# EAGLE design Brake Light Board (1) (EAGLE 6.5.0)
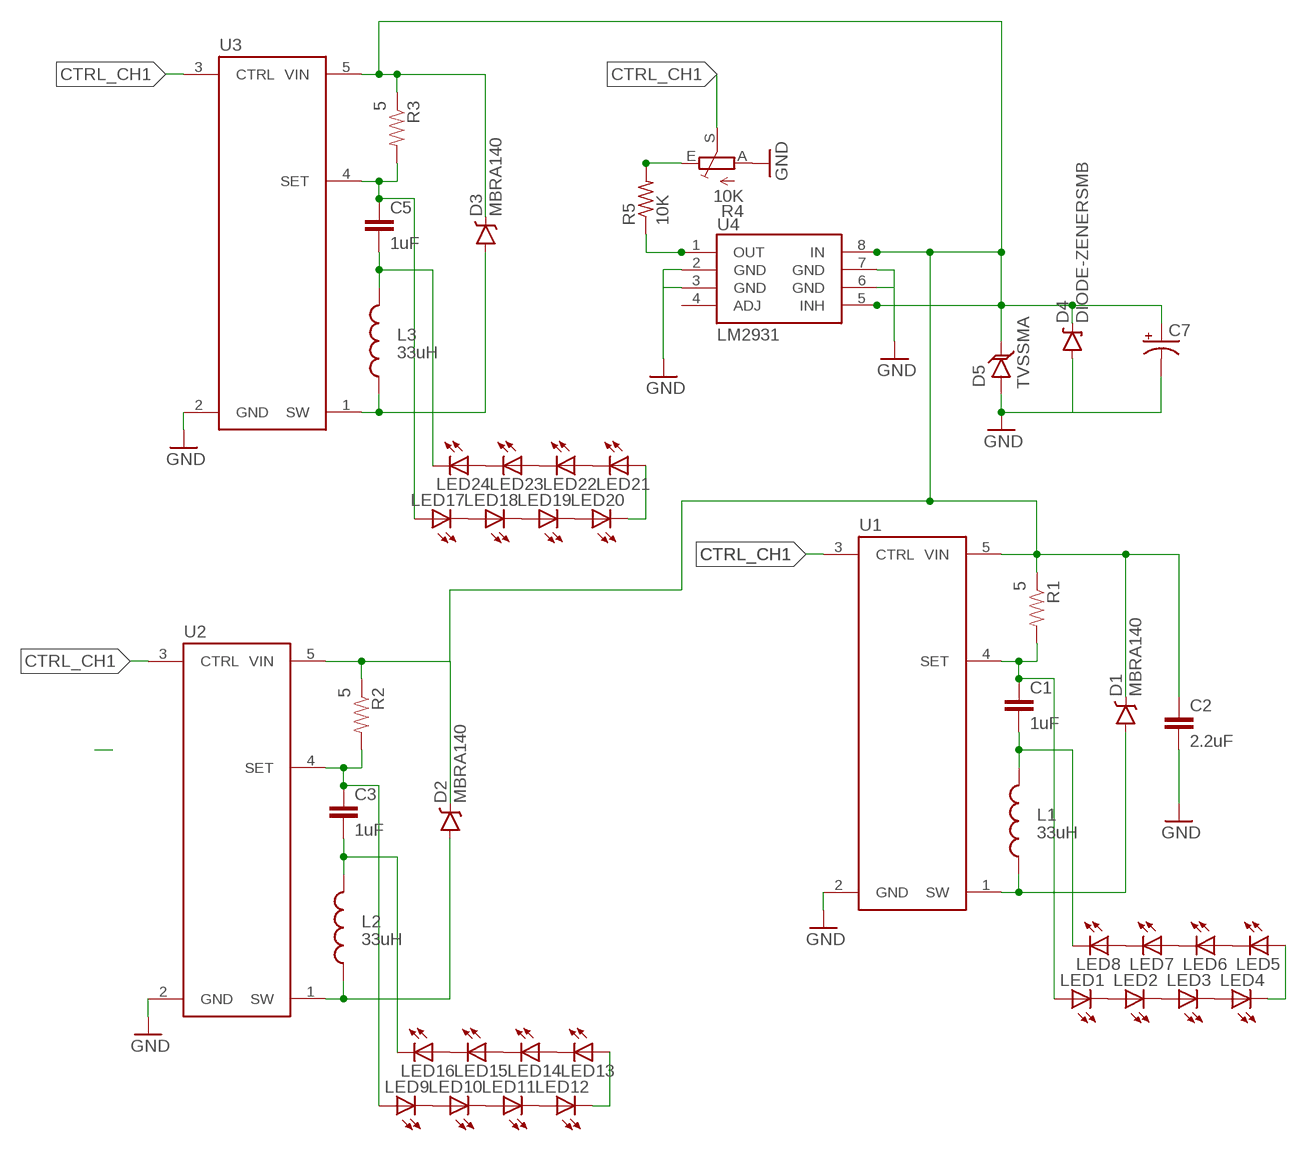
[diagram p0: schematic, sheet 1]

## Parts
C1  1uF  1.0UF50V10%(1206)  [1206]
C2  2.2uF  2.2UF50V10%(1206)  [1206]
C3  1uF  1.0UF50V10%(1206)  [1206]
C5  1uF  1.0UF50V10%(1206)  [1206]
C7  CAP_POL6032  [EIA6032]
D1  MBRA140  DIODE-SCHOTTKY-MBRA140  [SMA-DIODE]
D2  MBRA140  DIODE-SCHOTTKY-MBRA140  [SMA-DIODE]
D3  MBRA140  DIODE-SCHOTTKY-MBRA140  [SMA-DIODE]
D4  DIODE-ZENERSMB  [SMB-DIODE]
D5  TVSSMA  [SMA-DIODE]
L1  33uH  INDUCTORBOURNS_SRN6045  [SRN6045]
L2  33uH  INDUCTORBOURNS_SRN6045  [SRN6045]
L3  33uH  INDUCTORBOURNS_SRN6045  [SRN6045]
LED1  LED5MM  [LED5MM]
LED2  LED5MM  [LED5MM]
LED3  LED5MM  [LED5MM]
LED4  LED5MM  [LED5MM]
LED5  LED5MM  [LED5MM]
LED6  LED5MM  [LED5MM]
LED7  LED5MM  [LED5MM]
LED8  LED5MM  [LED5MM]
LED9  LED5MM  [LED5MM]
LED10  LED5MM  [LED5MM]
LED11  LED5MM  [LED5MM]
LED12  LED5MM  [LED5MM]
LED13  LED5MM  [LED5MM]
LED14  LED5MM  [LED5MM]
LED15  LED5MM  [LED5MM]
LED16  LED5MM  [LED5MM]
LED17  LED5MM  [LED5MM]
LED18  LED5MM  [LED5MM]
LED19  LED5MM  [LED5MM]
LED20  LED5MM  [LED5MM]
LED21  LED5MM  [LED5MM]
LED22  LED5MM  [LED5MM]
LED23  LED5MM  [LED5MM]
LED24  LED5MM  [LED5MM]
R1  5  0.3OHM-1/8W-1%(0805)  [0805]
R2  5  0.3OHM-1/8W-1%(0805)  [0805]
R3  5  0.3OHM-1/8W-1%(0805)  [0805]
R4  10K  TRIM_EU-B25P  [B25P]
R5  10K  R-US_R0805  [R0805]
U1  AL8805  [SOT23-5]
U2  AL8805  [SOT23-5]
U3  AL8805  [SOT23-5]
U4  LM2931  [SO08]

## Nets
CTRL_CH1: R4.S U1.3(CTRL) U2.3(CTRL) U3.3(CTRL)
GND: C2.2 C7.P$2(-) D4.A D5.A R4.A U1.2(GND) U2.2(GND) U3.2(GND) U4.2(GND) U4.6(GND) U4.7(GND)
N$1: LED1.K(C) LED2.A
N$2: LED2.K(C) LED3.A
N$3: LED3.K(C) LED4.A
N$4 [power]: C1.2 L1.2 LED8.K(C)
N$5: LED5.K(C) LED6.A
N$6: LED6.K(C) LED7.A
N$7: LED7.K(C) LED8.A
N$8: LED9.K(C) LED10.A
N$9: LED4.K(C) LED5.A
N$10: LED10.K(C) LED11.A
N$11: LED11.K(C) LED12.A
N$12 [power]: C3.2 L2.2 LED16.K(C)
N$13: LED13.K(C) LED14.A
N$14: LED14.K(C) LED15.A
N$15: LED15.K(C) LED16.A
N$16: LED12.K(C) LED13.A
N$17: LED17.K(C) LED18.A
N$18: LED18.K(C) LED19.A
N$19: LED19.K(C) LED20.A
N$20 [power]: C5.2 L3.2 LED24.K(C)
N$21: LED21.K(C) LED22.A
N$22: LED22.K(C) LED23.A
N$23: LED23.K(C) LED24.A
N$24: LED20.K(C) LED21.A
N$25: R4.E R5.2
N$26: R5.1 U4.1(OUT)
N$28: U4.3(GND)
OUT+: C1.1 LED1.A R1.2 U1.4(SET)
OUT+1: C3.1 LED9.A R2.2 U2.4(SET)
OUT+2: C5.1 LED17.A R3.2 U3.4(SET)
SW: D1.A L1.1 U1.1(SW)
SW1: D2.A L2.1 U2.1(SW)
SW2: D3.A L3.1 U3.1(SW)
VIN: C2.1 C7.P$1(+) D1.C D2.C D3.C D4.C D5.C R1.1 R2.1 R3.1 U1.5(VIN) U2.5(VIN) U3.5(VIN) U4.5(INH) U4.8(IN)
Unconnected: U4.4(ADJ)

## Library data of the parts
C1 C3 C5 = SparkFun-Capacitors:1.0UF50V10%(1206): CAP-09822; PROD_ID: CAP-09822; VALUE: 1.0uF
C2 = SparkFun-Capacitors:2.2UF50V10%(1206): CAP-10009; PROD_ID: CAP-10009; VALUE: 2.2UF
C7 = SparkFun-Capacitors:CAP_POL: Capacitor Polarized These are standard SMD and PTH capacitors. Normally 10uF, 47uF, and 100uF in electrolytic and tantalum varieties. Always verify the external diameter of the through hole cap, it varies with capacity, voltage, and manufacturer. The EIA devices should be standard.
D1-D3 = SparkFun-DiscreteSemi:DIODE-SCHOTTKY: Schottky diodes in SFE's production catalog BAT20J 1A 23V 0.62Vf RB751 120mA 40V 0.37Vf PMEG4005EJ 0.5A 40V 0.42Vf MBRA140 1A 40V 0.5Vf B340A 3A 40V SMA; PROD_ID: DIO-08053
D4 = SparkFun-DiscreteSemi:DIODE-ZENER: Zener Diode Production Part - 8199 3.4V Zener Voltage
D5 = SparkFun-DiscreteSemi:TVS: Transient voltage suppressor- prevents ESD on inputs.
L1-L3 = SparkFun-Passives:INDUCTOR: Inductors Basic Inductor/Choke - 0603 and 1206. Footprints are not proven and vary greatly between part numbers. SRN6045- 33uH, 20% 1.4A SDR0403-560KL - 56uH, 10%, 500mA RMS/740mA peak; PROD_ID: NDUC-11627
LED1-LED24 = led:LED: LED OSRAM: - CHIPLED LG R971, LG N971, LY N971, LG Q971, LY Q971, LO R971, LY R971 LH N974, LH R974 LS Q976, LO Q976, LY Q976 LO Q996 - Hyper CHIPLED LW Q18S LB Q993, LB Q99A, LB R99A - SideLED LS A670, LO A670, LY A670, LG A670, LP A670 LB A673, LV A673, LT A673, LW A673 LH A674 LY A675 LS A676, LA A676, LO A676, LY A676, LW A676 LS A679, LY A679, LG A679 - Hyper Micro SIDELED® LS Y876, LA Y876, LO Y876, LY Y876 LT Y87S - SmartLED LW L88C, LW L88S LB L89C, LB L89S, LG L890 LS L89K, LO L89K, LY L89K LS L896, LA L896, LO L896, LY L896 - TOPLED LS T670, LO T670, LY T670, LG T670, LP T670 LSG T670, LSP T670, LSY T670, LOP T670, LYG T670 LG T671, LOG T671, LSG T671 LB T673, LV T673, LT T673, LW T673 LH T674 LS T676, LA T676, LO T676, LY T676, LB T676, LH T676, LSB T676, LW T676 LB T67C, LV T67C, LT T67C, LS T67K, LO T67K, LY T67K, LW E67C LS E67B, LA E67B, LO E67B, LY E67B, LB E67C, LV E67C, LT E67C LW T67C LS T679, LY T679, LG T679 LS T770, LO T770, LY T770, LG T770, LP T770 LB T773, LV T773, LT T773, LW T773 LH T774 LS E675, LA E675, LY E675, LS T675 LS T776, LA T776, LO T776, LY T776, LB T776 LHGB T686 LT T68C, LB T68C - Hyper Mini TOPLED® LB M676 - Mini TOPLED Santana® LG M470 LS M47K, LO M47K, LY M47K Source: http://www.osram.convergy.de LUXEON: - LUMILED® LXK2-PW12-R00, LXK2-PW12-S00, LXK2-PW14-U00, LXK2-PW14-V00 LXK2-PM12-R00, LXK2-PM12-S00, LXK2-PM14-U00 LXK2-PE12-Q00, LXK2-PE12-R00, LXK2-PE12-S00, LXK2-PE14-T00, LXK2-PE14-U00 LXK2-PB12-K00, LXK2-PB12-L00, LXK2-PB12-M00, LXK2-PB14-N00, LXK2-PB14-P00, LXK2-PB14-Q00 LXK2-PR12-L00, LXK2-PR12-M00, LXK2-PR14-Q00, LXK2-PR14-R00 LXK2-PD12-Q00, LXK2-PD12-R00, LXK2-PD12-S00 LXK2-PH12-R00, LXK2-PH12-S00 LXK2-PL12-P00, LXK2-PL12-Q00, LXK2-PL12-R00 Source: www.luxeon.com KINGBRIGHT: KA-3528ASYC Source: www.kingbright.com
R1-R3 = SparkFun-Resistors:0.3OHM-1/8W-1%(0805): RES-11622; PROD_ID: RES-11622; VALUE: 0.3
R4 = pot:TRIM_EU-: POTENTIOMETER
R5 = resistor:R-US_: RESISTOR, American symbol
U1-U3 = SparkFun-PowerIC:AL8805: Constant current LED driver PWM-able 1MHz switch freq 6V-36V Up to 1A LED current; PROD_ID: IC-11626; VALUE: AL8805WS
U4 = SparkFun-PowerIC:LM2931: LDO regulator with reverse battery protection- very durable!

## Net classes
0 default: width 0.254 mm
1 power: width 0.508 mm

## Board
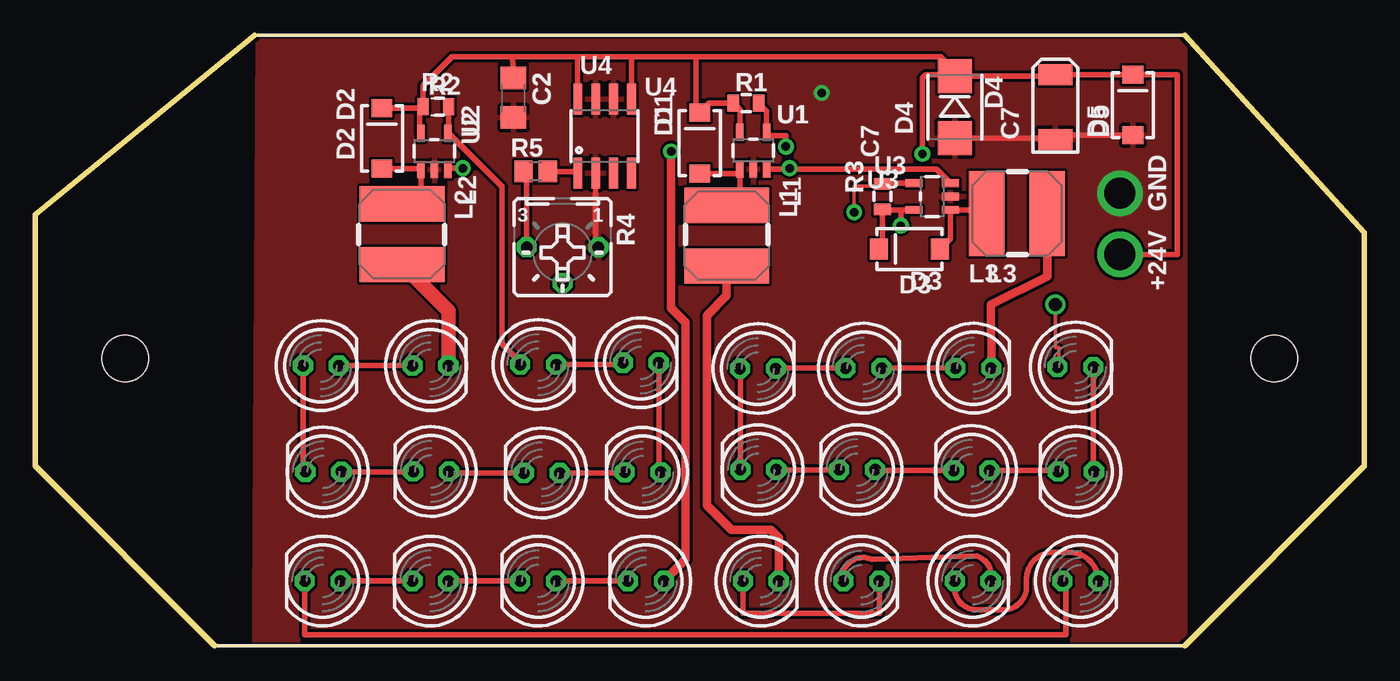
[diagram p1: board, top side]
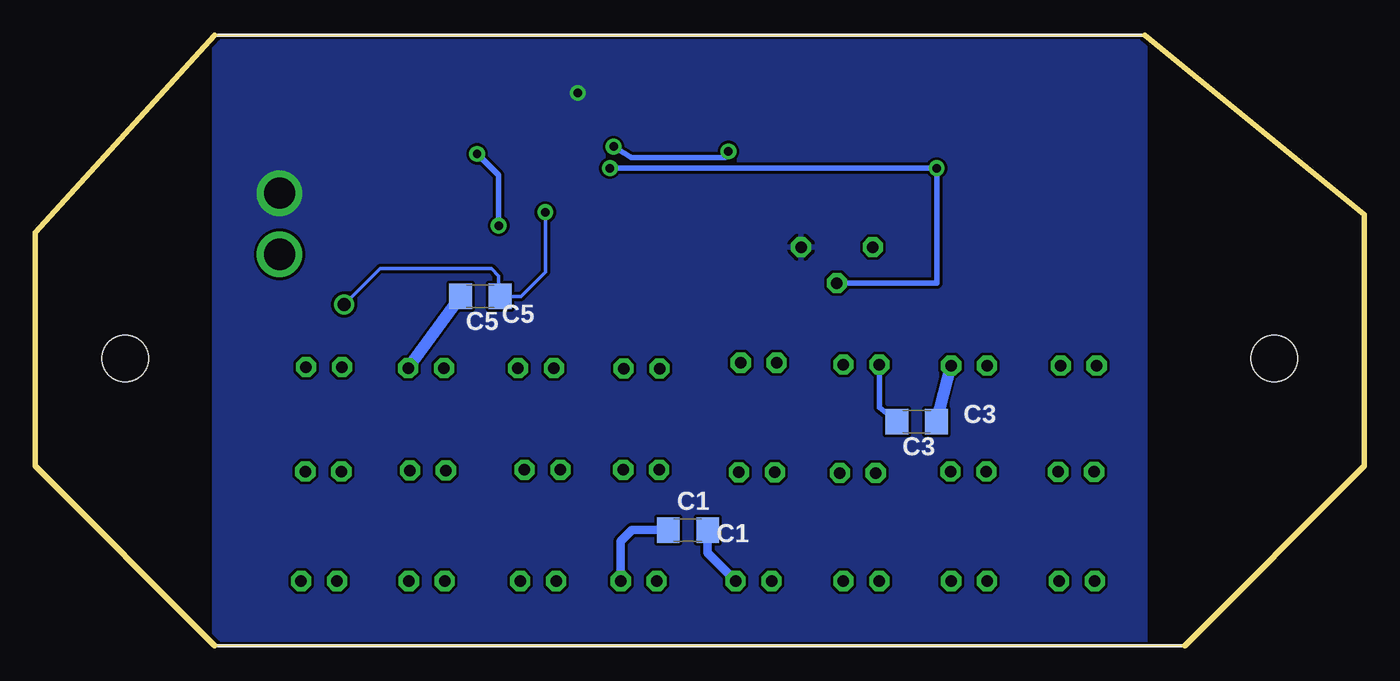
[diagram p2: board, bottom side, seen from below]

Size 93.98 x 43.18 mm. Coordinates in mm from the lower left corner, seen from the top.
Outline: 12.7,0 81.28,0 93.98,12.7 93.98,29.21 81.28,43.18 15.49,43.18 0,30.48 0,12.7 12.7,0
Copper layers (1*16): Top 0.035mm / dielectric 1.5mm / Bottom 0.035mm
Design rules "SparkFun": minimum track width 8mil, minimum drill 20mil, track to track 8mil, track to pad 8mil, pad to pad 8mil, via to via 8mil, smd to smd 8mil, copper to edge 10mil, drill to drill 8mil, minimum pad ring 12mil, minimum via ring 10mil, stop-mask expansion 4mil, vias tented up to drill 25mil, thermal gap 10mil
Holes 3.3 mm at 6.35,20.32 87.63,20.32

### Footprints (pad centres in the part's own frame; a part is rotated, then mirrored left to right if it is on the bottom)
1206 = smd 1.6 x 1.8: 1 -1.4,0; 2 1.4,0
EIA6032 = smd 1.5 x 2.4: P$1 -2.3,0; P$2 2.3,0
SMA-DIODE = smd 1.27 x 1.47: A -2.15,0; C 2.15,0
SMB-DIODE = smd 2.4 x 2.4: A 2.2,0; C -2.2,0
SRN6045 = smd 2.5 x 6: 1 -2.175,-0.175; 2 2.125,-0.175
LED5MM = drill 0.813 octagon: A -1.27,0; K 1.27,0
0805 = smd 0.8 x 1.2: 1 -0.9,0; 2 0.9,0
B25P = drill 0.813 octagon: A -2.54,0; E 2.54,0; S 0,2.54
R0805 = smd 1.3 x 1.5: 1 -0.85,0; 2 0.85,0
SOT23-5 = smd 0.55 x 1.2: 1 -0.95,-1.3; 2 0,-1.3; 3 0.95,-1.3; 4 0.95,1.3; 5 -0.95,1.3
SO08 = smd 0.61 x 2.21: 1 -1.905,-2.616; 2 -0.635,-2.616; 3 0.635,-2.616; 4 1.905,-2.616; 5 1.905,2.616; 6 0.635,2.616; 7 -0.635,2.616; 8 -1.905,2.616

### Placement (x,y rotation side)
C1  47.83,8.18 180 bottom
C2  33.81,38.76 270 top
C3  31.65,15.85 0 bottom
C5  62.51,24.71 180 bottom
C7  72.14,38.1 270 top
D1  46.99,35.56 90 top
D2  24.51,35.89 90 top
D3  61.82,28.07 180 top
D4  65.02,38.1 270 top
D5  77.62,38.25 90 top
L1  49.07,28.98 270 top
L2  26.11,29.08 270 top
L3  69.44,30.73 0 top
LED1  43.18,4.57 180 top
LED2  35.56,4.57 180 top
LED3  27.94,4.57 180 top
LED4  20.32,4.57 180 top
LED5  73.91,4.57 0 top
LED6  66.29,4.57 0 top
LED7  58.42,4.57 0 top
LED8  51.31,4.57 0 top
LED9  35.56,19.89 0 top
LED10  42.82,20.02 0 top
LED11  42.95,12.27 180 top
LED12  35.81,12.22 180 top
LED13  27.99,12.32 180 top
LED14  20.37,12.29 180 top
LED15  20.19,19.81 0 top
LED16  27.94,19.81 0 top
LED17  73.56,19.71 0 top
LED18  73.61,12.32 180 top
LED19  66.22,12.4 180 top
LED20  58.12,12.45 180 top
LED21  51.13,12.45 180 top
LED22  51.1,19.61 0 top
LED23  58.57,19.63 0 top
LED24  66.34,19.63 0 top
R1  50.27,38.38 0 top
R2  28.32,38.13 0 top
R3  59.92,31.78 90 top
R4  37.29,28.19 180 top
R5  35.38,33.55 180 top
U1  50.77,35.03 0 top
U2  28.22,34.98 0 top
U3  63.42,31.78 90 top
U4  40.26,36.04 0 top

### Tracks (layer width: path | path; a pad name or v marks a point on that pad's centre or on a via)
CTRL_CH1  (via drill 0.6)
  Top 0.406: 51.72,33.68 U1.3 52.83,33.73 | U3.3 63.72,33.73 52.83,33.73 | v30.23,33.78 29.21,33.78 U2.3 | v53.34,33.78 52.83,33.73
  Bottom 0.406: v53.34,33.78 v30.23,33.78 30.23,25.65 R4.S
GND  (via drill 0.6 pad 1.02, 2.2)
  Top 0.406: D5.A 72.14,36.1 C7.P$2 72.04,35.9 D4.A | R4.A 39.62,28.4 U4.2
  other vias: 76.71,32 55.63,39.12
  pour Top: 15.75,43.18 81.28,43.18 81.28,0 15.49,0 15.49,2.54
  pour Bottom: 15.49,43.18 81.28,43.18 81.28,0 15.49,0
N$1
  Top 0.406: LED2.A LED1.K
N$2
  Top 0.406: LED3.A LED2.K
N$3
  Top 0.406: LED4.A LED3.K
N$4
  Top 0.61: L1.2 48.9,24.77 47.5,23.37 47.5,9.91 C1.2 52.02,8.18 52.58,7.62 LED8.K
  Bottom 0.61: C1.2 51.76,8.18 52.58,7.37 LED8.K
N$5
  Top 0.406: LED6.A 65.02,4.06 arc90 66.55,2.54 68.33,2.54 arc90 70.1,4.06 70.1,4.57 arc-90 71.88,6.6 73.15,6.6 arc-90 LED5.K
N$6
  Top 0.406: LED7.A 57.15,5.33 arc-90 59.18,6.1 66.55,6.35 arc-90 LED6.K
N$7
  Top 0.406: LED8.A 50.04,2.29 59.69,2.29 LED7.K
N$8
  Top 0.406: LED10.A 41.55,19.89 LED9.K
N$9
  Top 0.406: LED4.K 19.05,0.76 72.9,0.76 72.9,4.57 LED5.A
N$10
  Top 0.406: LED10.K 44.09,12.27 LED11.A
N$11
  Top 0.406: LED11.K 41.68,12.22 LED12.A
N$12
  Top 1.016: L2.2 29.21,23.68 LED16.K
  Bottom 0.813: C3.2 LED16.K
N$13
  Top 0.406: LED13.K 26.72,12.29 LED14.A
N$14
  Top 0.406: LED15.A 18.92,12.29 LED14.K
N$15
  Top 0.406: LED15.K LED16.A
N$16
  Top 0.406: LED13.A 29.26,12.22 LED12.K
N$17
  Top 0.406: LED17.K 74.83,12.32 LED18.A
N$18
  Top 0.406: LED19.A 72.34,12.39 LED18.K
N$19
  Top 0.406: LED19.K 59.38,12.39 LED20.A
N$20
  Top 0.61: L3.2 71.57,26.1 67.56,24.13 LED24.K
  Bottom 0.813: LED24.K C5.2
N$21
  Top 0.406: LED22.A 49.86,19.61 LED21.K
N$22
  Top 0.406: LED23.A 52.38,19.63 LED22.K
N$23
  Top 0.406: LED24.A LED23.K
N$24
  Top 0.406: LED21.A LED20.K
N$25
  Top 0.406: R5.2 34.75,33.55 R4.E
N$26
  Top 0.406: R5.1 38.35,33.55 U4.1
OUT+  (via drill 0.6)
  Top 0.406: R1.2 51.72,37.82 U1.4 51.82,36.32 51.82,36.07 53.09,36.07 v53.09,35.31
  Top 0.61: LED1.A 45.97,6.1 45.97,22.86 44.96,23.88 v44.96,34.98
  Bottom 0.406: v53.09,35.31 51.82,34.54 45.21,34.54 v44.96,34.98
  Bottom 0.61: C1.1 46.43,6.55 LED1.A
OUT+1
  Top 0.406: U2.4 29.22,36.28 | 29.22,36.28 R2.2 | 29.22,36.28 33.02,32.48 33.02,21.34 34.04,20.32 34.29,20.32 LED9.A
  Bottom 0.406: C3.1 34.29,16.84 LED9.A
OUT+2  (via drill 0.6, 0.9)
  Top 0.254: v57.91,30.67 57.91,32.51 59.75,32.51 R3.2 | LED17.A 72.39,19.81 72.39,21.08 72.14,21.08 v72.14,24.13
  Top 0.406: R3.2 59.97,32.73 U3.4
  Bottom 0.254: v57.91,30.67 57.91,26.42 59.61,24.71 C5.1 61.21,24.89 61.21,26.16 61.72,26.67 69.6,26.67 v72.14,24.13
SW
  Top 0.406: L1.1 49.82,31.16 U1.1 49.82,33.41 D1.A
SW1
  Top 0.406: D2.A 27.27,33.74 U2.1 27.27,31.26 L2.1
SW2
  Top 0.406: D3.A 64.72,28.82 U3.1 67.27,30.82 L3.1
VIN  (via drill 0.6, 2.2)
  Top 0.406: 80.77,27.67 80.77,27.69 | 80.77,27.69 80.77,40.39 77.62,40.39 D5.C C7.P$1 72.04,40.3 D4.C | D3.C 59.92,28.31 R3.1 59.97,30.82 61.21,30.82 | 61.21,30.82 U3.5 | 27.42,38.04 R2.1 | U1.5 49.82,37.92 R1.1 47.66,38.38 D1.C 46.74,37.71 46.74,41.66 | R2.1 27.59,38.04 27.18,38.04 | 27.18,38.04 D2.C | R2.1 27.42,39.61 29.46,41.66 | 29.46,41.66 38.35,41.66 | 38.35,41.66 42.16,41.66 | 42.16,41.66 46.74,41.66 | 46.74,41.66 64.01,41.66 65.02,40.64 D4.C | 29.46,41.66 33.75,41.68 C2.1 | v61.21,29.72 61.21,30.82 | v62.74,34.8 62.74,40.13 62.99,40.39 64.26,40.39 64.77,39.88 65.02,40.13 D4.C | U2.5 27.18,36.28 27.18,38.04 | v76.71,27.69 80.77,27.69 | U4.5 42.16,41.66 | U4.8 38.35,41.66
  Bottom 0.406: v61.21,29.72 61.21,33.27 v62.74,34.8

### Text on the board
tNames: C7
_tsilk: U4 | C2 | R2 | R1 | U1 | R5 | D1 | D4 | C7 | D5 | U2 | U3 | D2 | L2 | L1 | R3 | 3 | 1 | R4 | GND | D3 | L3 | +24V
_bsilk: C5 | C3 | C1